# EasyEDA schematic armor_schematic_std_single.json
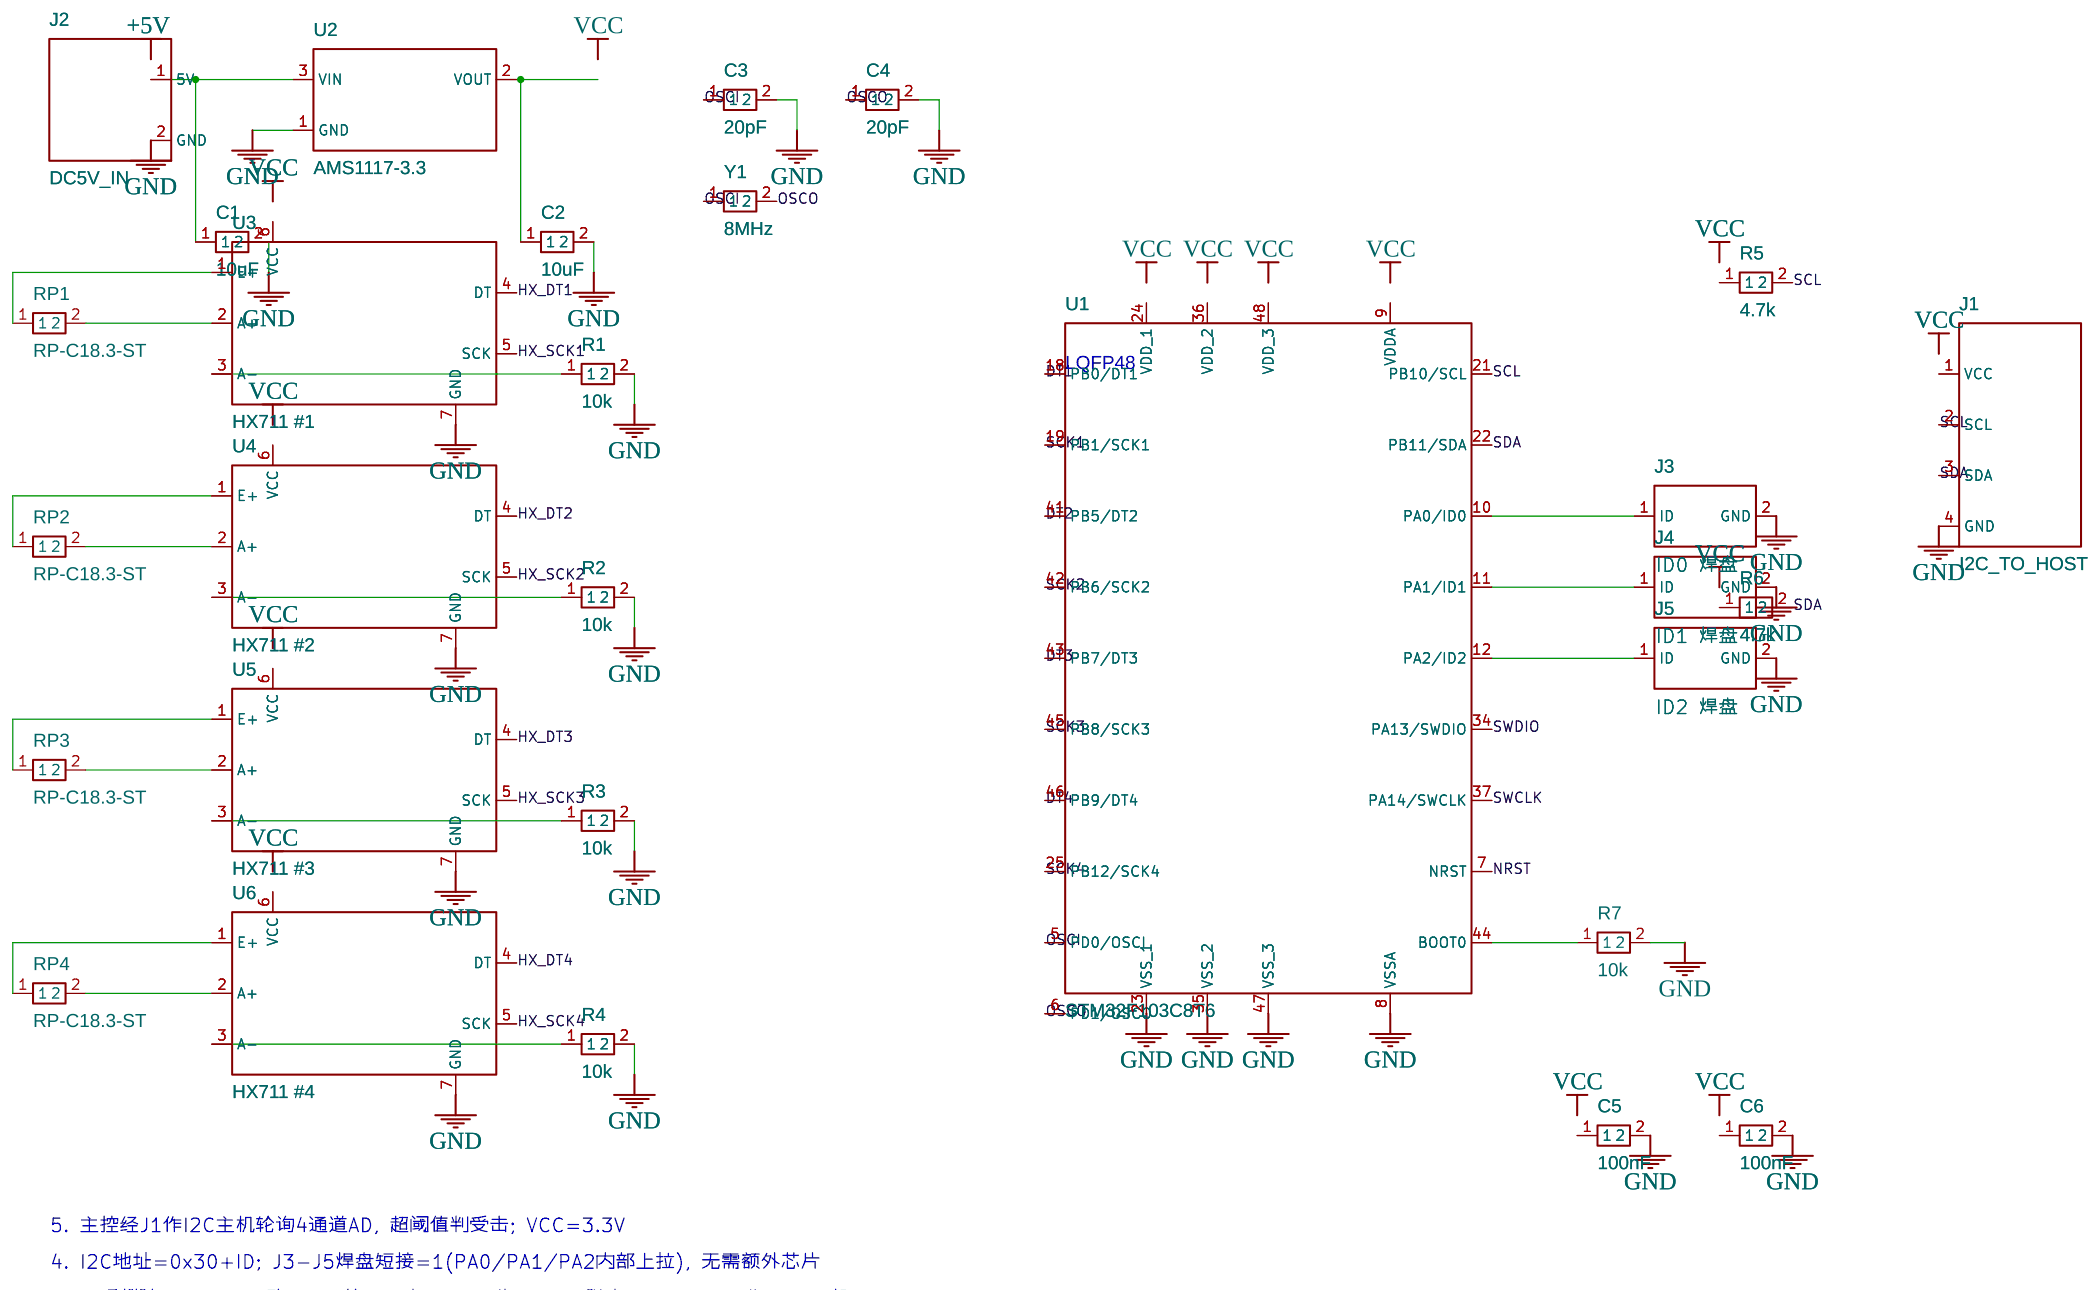
[diagram p0: schematic sheet]

## Parts
C1  10uF  [C0805]
C2  10uF  [C0805]
C3  20pF  [C0603]
C4  20pF  [C0603]
C5  100nF  [C0603]
C6  100nF  [C0603]
J1  I2C_TO_HOST  [HDR-TH_4P-P2.54]
J2  DC5V_IN  [HDR-TH_2P-P2.54]
J3  ID0 焊盘  [HDR-TH_2P-P2.54]
J4  ID1 焊盘  [HDR-TH_2P-P2.54]
J5  ID2 焊盘  [HDR-TH_2P-P2.54]
R1  10k  [R0603]
R2  10k  [R0603]
R3  10k  [R0603]
R4  10k  [R0603]
R5  4.7k  [R0603]
R6  4.7k  [R0603]
R7  10k  [R0603]
RP1  RP-C18.3-ST
RP2  RP-C18.3-ST
RP3  RP-C18.3-ST
RP4  RP-C18.3-ST
U1  STM32F103C8T6  [LQFP-48]
U2  AMS1117-3.3  [SOT-223]
U3  HX711 #1
U4  HX711 #2
U5  HX711 #3
U6  HX711 #4
Y1  8MHz  [SMD5032-2P]

## Library data of the parts
C1 C2 = 10uF: Manufacturer Part: CL21A106KAYNNNE; Supplier Part: C15850; Supplier: LCSC
C3 C4 = 20pF: Manufacturer Part: CL10C200JB8NNNC
C5 C6 = 100nF: Manufacturer Part: CC0603KRX7R9BB104; Supplier Part: C14663; Supplier: LCSC
J1 = I2C_TO_HOST: Manufacturer Part: PZ254V-11-04P; Supplier Part: C2691448; Supplier: LCSC
J2 = DC5V_IN: Manufacturer Part: PZ254V-11-02P
J3 = ID0 焊盘: Manufacturer Part: PZ254V-11-02P
J4 = ID1 焊盘: Manufacturer Part: PZ254V-11-02P
J5 = ID2 焊盘: Manufacturer Part: PZ254V-11-02P
R1-R4 R7 = 10k: Manufacturer Part: 0603WAF1002T5E; Supplier Part: C25804; Supplier: LCSC
R5 R6 = 4.7k: Manufacturer Part: 0603WAF4701T5E
RP1-RP4 = RP-C18.3-ST
U1 = STM32F103C8T6: Supplier Part: C8734; Supplier: LCSC
U2 = AMS1117-3.3: Supplier Part: C6186; Supplier: LCSC
U3 = HX711 #1: Manufacturer Part: HX711 module
U4 = HX711 #2: Manufacturer Part: HX711 module
U5 = HX711 #3: Manufacturer Part: HX711 module
U6 = HX711 #4: Manufacturer Part: HX711 module
Y1 = 8MHz: Manufacturer Part: 7U08000E10UCG; Supplier Part: C251585; Supplier: LCSC

## Nets
GND: C1.2 C2.2 C3.2 C4.2 C5.2 C6.2 J1.4(GND) J2.2(GND) J3.2(GND) J4.2(GND) J5.2(GND) R1.2 R2.2 R3.2 R4.2 R7.2 U1.8(VSSA) U1.23(VSS_1) U1.35(VSS_2) U1.47(VSS_3) U2.1(GND) U3.7(GND) U4.7(GND) U5.7(GND) U6.7(GND)
DT1: U1.18(PB0/DT1)
DT2: U1.41(PB5/DT2)
DT3: U1.43(PB7/DT3)
DT4: U1.46(PB9/DT4)
HX_DT1: U3.4(DT)
HX_DT2: U4.4(DT)
HX_DT3: U5.4(DT)
HX_DT4: U6.4(DT)
HX_SCK1: U3.5(SCK)
HX_SCK2: U4.5(SCK)
HX_SCK3: U5.5(SCK)
HX_SCK4: U6.5(SCK)
NRST: U1.7(NRST)
OSCI: C3.1 U1.5(PD0/OSCI) Y1.1
OSCO: C4.1 U1.6(PD1/OSCO) Y1.2
SCK1: U1.19(PB1/SCK1)
SCK2: U1.42(PB6/SCK2)
SCK3: U1.45(PB8/SCK3)
SCK4: U1.25(PB12/SCK4)
SCL: J1.2(SCL) R5.2 U1.21(PB10/SCL)
SDA: J1.3(SDA) R6.2 U1.22(PB11/SDA)
SWCLK: U1.37(PA14/SWCLK)
SWDIO: U1.34(PA13/SWDIO)
Net-(C1-1): C1.1 J2.1(5V) U2.3(VIN)
Net-(C2-1): C2.1 U2.2(VOUT)
Net-(J3-1): J3.1(ID) U1.10(PA0/ID0)
Net-(J4-1): J4.1(ID) U1.11(PA1/ID1)
Net-(J5-1): J5.1(ID) U1.12(PA2/ID2)
Net-(R1-1): R1.1 U3.3(A-)
Net-(R2-1): R2.1 U4.3(A-)
Net-(R3-1): R3.1 U5.3(A-)
Net-(R4-1): R4.1 U6.3(A-)
Net-(R7-1): R7.1 U1.44(BOOT0)
Net-(RP1-1): RP1.1 U3.1(E+)
Net-(RP1-2): RP1.2 U3.2(A+)
Net-(RP2-1): RP2.1 U4.1(E+)
Net-(RP2-2): RP2.2 U4.2(A+)
Net-(RP3-1): RP3.1 U5.1(E+)
Net-(RP3-2): RP3.2 U5.2(A+)
Net-(RP4-1): RP4.1 U6.1(E+)
Net-(RP4-2): RP4.2 U6.2(A+)

Not connected (* = marked no-connect by the designer): C5 1; C6 1; J1 1(VCC); R5 1; R6 1; U1 9(VDDA) 24(VDD_1) 36(VDD_2) 48(VDD_3); U3 6(VCC); U4 6(VCC); U5 6(VCC); U6 6(VCC)

## Notes on the sheet
- LQFP48
- 5. 主控经J1作I2C主机轮询4通道AD, 超阈值判受击; VCC=3.3V
- 4. I2C地址=0x30+ID; J3-J5焊盘短接=1(PA0/PA1/PA2内部上拉), 无需额外芯片
- 3. U1引脚与hx711.c一致; CH4的SCK由PB10改为PB12, 腾出PB10/PB11作I2C2从机
- 2. 半桥: 传感器->E+/A+, A-经10k配平电阻接GND; HX711统一3.3V供电
- 1. 传感器 RP1-RP4: RP-C18.3-ST 薄膜压敏, 贴于装甲板背面4象限
- 装甲板受击检测节点：4x薄膜压敏 + 4xHX711 + STM32F103C8T6 (I2C2从机, VCC=3.3V)
